# Altium project WiFi_Shield.PrjPcb
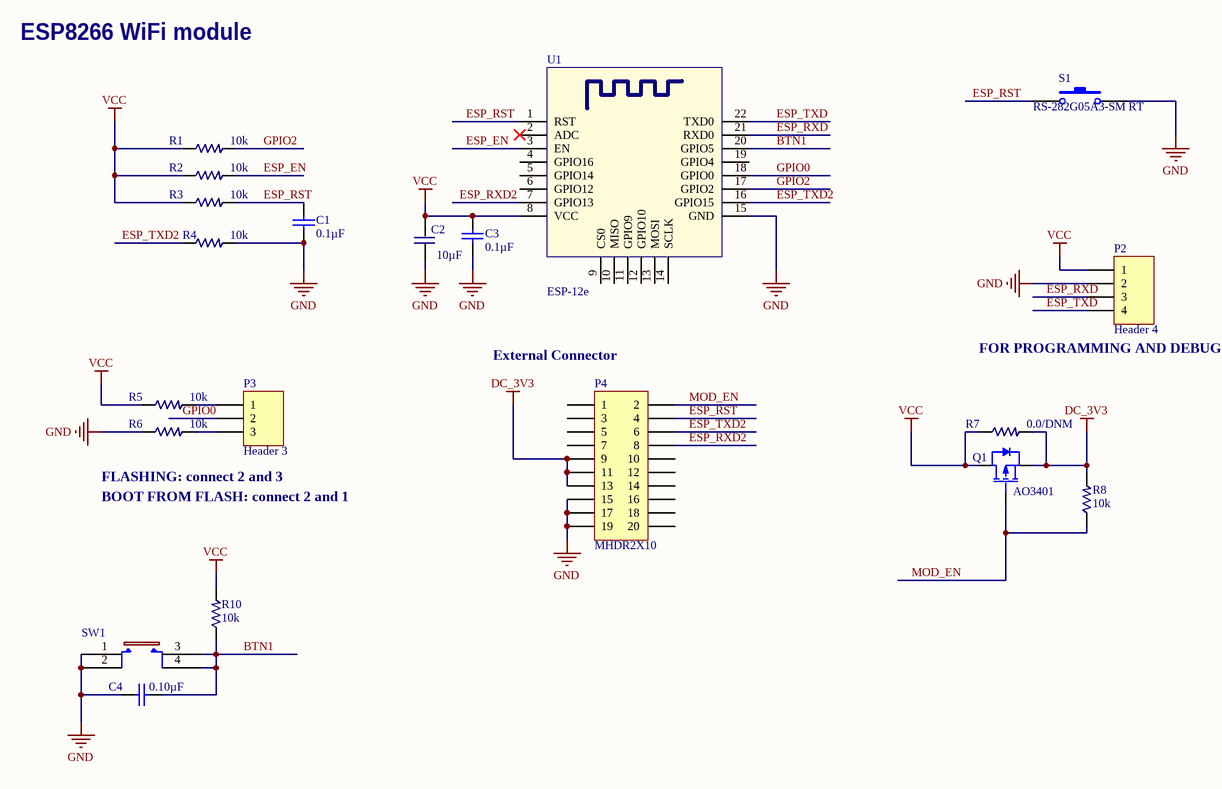
[diagram p0: WiFi Shield Schematic.SchDoc]
1 sheet, 20 parts. Net scope: global (net labels, ports and power ports of the same name join across sheets).
Board file: WiFi_Shield_PCB.PcbDoc

## Sheet WiFi Shield Schematic.SchDoc: WiFi Shield Schematic
size A4

### Parts
C1  0.1µF  [C0402M]
C2  10µF  [C0603M]
C3  0.1µF  [C0402M]
C4  0.10µF  [C0402M]
P2  Header 4  [HDR1X4]
P3  Header 3  [HDR1X3]
P4  MHDR2X10  [MHDR2X10SMDM]
Q1  AO3401  [SOT95P240X120-3N]
R1  10k  [R0402M]
R2  10k  [R0402M]
R3  10k  [R0402M]
R4  10k  [R0402M]
R5  10k  [R0402M]
R6  10k  [R0402M]
R7  0.0/DNM  [R0805M]
R8  10k  [R0402M]
R10  10k  [R0402M]
S1  RS-282G05A3-SM RT  [RS-282G05A3]
SW1  PTS645SL70SMTR92LFS  [PTS645SL70SMTR92LFS]  (value not drawn)
U1  ESP-12e  [ESP-12E]

### Nets
DC_3V3: P4.9 P4.11 P4.13 Q1.2(S) R7.1 R8.1
GND: C1.2 C2.1 C3.2 C4.2 P2.2 P4.15 P4.17 P4.19 R4.1 R6.2 S1.2 SW1.1 SW1.2 U1.15(GND)
VCC: C2.2 C3.1 P2.1 Q1.3(D) R1.2 R2.2 R3.2 R5.2 R7.2 R10.1 U1.8(VCC)
BTN1: C4.1 R10.2 SW1.3 SW1.4 U1.20(GPIO5)
ESP_EN: R2.1 U1.3(EN)
ESP_RST: C1.1 P4.4 R3.1 S1.1 U1.1(RST)
ESP_RXD: P2.3 U1.21(RXD0)
ESP_RXD2: P4.8 U1.7(GPIO13)
ESP_TXD: P2.4 U1.22(TXD0)
ESP_TXD2: P4.6 R4.2 U1.16(GPIO15)
GPIO0: P3.2 U1.18(GPIO0)
GPIO2: R1.1 U1.17(GPIO2)
MOD_EN: P4.2 Q1.1(G) R8.2
NetP3_1: P3.1 R5.1
NetP3_3: P3.3 R6.1

Not connected (* = marked no-connect by the designer): P4 1 3 5 7 10 12 14 16 18 20; U1 2(ADC)* 4(GPIO16) 5(GPIO14) 6(GPIO12) 9(CS0) 10(MISO) 11(GPIO9) 12(GPIO10) 13(MOSI) 14(SCLK) 19(GPIO4)

### Notes on the sheet
- ESP8266 WiFi module
- (near P4) External Connector
- (near P2) FOR PROGRAMMING AND DEBUG
- FLASHING: connect 2 and 3
- BOOT FROM FLASH: connect 2 and 1
- Title
- Size:
- Date:
- A4
- Number:
- Time:
- Revision:
- Sheet
- of
- THRAIN
- ManhNV
- Hanoi
- 27/68
- Vietnam
- File:

### Library data of the parts
C1 C3 = CAPN: Manufacturer: Murata Electronics North America; Manufacturer Part Number: GRM155R61C104KA88J; Tolerance: ±10%; Voltage - Rated: 16V; Temperature Coefficient: X5R; Notification: Current market demand for these product types have resulted in fluctuating and extending lead times. Lead times may differ.; Supplier 1: Digi-Key; Supplier Part Number 1: 490-6310-1-ND; RoHS: RoHS Compliant; Category: Capacitors; Stock 1: 500000; Pricing 1: 1=0.1, 10=0.035, 100=0.0155, 500=0.01106, 1000=0.0087, 2500=0.00791, 5000=0.00727 (USD); Packaging: Cut Tape (CT); Part Status: Active; Operating Temperature: -55°C ~ 85°C; Features: -; Ratings: -; Applications: General Purpose; Mounting Type: Surface Mount, MLCC; Package / Case: 0402 (1005 Metric); Size / Dimension: 0.039" L x 0.020" W (1.00mm x 0.50mm); Height - Seated (Max): -; Thickness (Max): 0.022" (0.55mm); Lead Spacing: -; ComponentLink1URL: https://www.murata.com/~/media/webrenewal/support/library/catalog/products/capacitor/mlcc/c02e.ashx; ComponentLink1Description: https://www.murata.com/~/media/webrenewal/support/library/catalog/products/capacitor/mlcc/c02e.ashx
C2 = CAPSMD: CAP CER 10UF 10V X5R 0603; Manufacturer: Taiyo Yuden; Manufacturer Part Number: LMK107BBJ106MAHT; Tolerance: ±20%; Supplier 1: Digi-Key; Supplier Part Number 1: 587-3412-1-ND; RoHS: RoHS Compliant; Category: Capacitors; Stock 1: 455125; Pricing 1: 1=0.44, 10=0.309, 100=0.1852, 500=0.1389, 1000=0.11729 (USD); Packaging: Cut Tape (CT); Part Status: Active; Voltage - Rated: 10V; Temperature Coefficient: X5R; Operating Temperature: -55°C ~ 85°C; Features: -; Ratings: AEC-Q200; Applications: Automotive; Mounting Type: Surface Mount, MLCC; Package / Case: 0603 (1608 Metric); Size / Dimension: 0.063" L x 0.032" W (1.60mm x 0.80mm); Height - Seated (Max): -; Thickness (Max): 0.035" (0.90mm); Lead Spacing: -; Lead Style: -; ComponentLink1URL: http://ds.yuden.co.jp/TYCOMPAS/ut/detail.do?productNo=LMK107BBJ106MAHT&fileName=LMK107BBJ106MAHT_SS&mode=specSheetDownload; ComponentLink1Description: http://ds.yuden.co.jp/TYCOMPAS/ut/detail.do?productNo=LMK107BBJ106MAHT&fileName=LMK107BBJ106MAHT_SS&mode=specSheetDownload; Capacitance: 10µF
C4 = CAPN: CAP CER 0.1UF 10V X5R 0402; Manufacturer: Taiyo Yuden; Manufacturer Part Number: LMK105BJ104KV-F; Tolerance: ±10%; Module: IPCAM SoC; Category 2: Capacitors; Notification: Current market demand for these product types have resulted in fluctuating and extending lead times. Lead times may differ.; Supplier 1: Digi-Key; Supplier Part Number 1: 587-1227-1-ND; RoHS: RoHS Compliant; Category: Capacitors; Stock 1: 12292406; Pricing 1: 1=0.1, 10=0.025, 50=0.012, 100=0.009, 250=0.00652, 500=0.0048, 1000=0.00325, 5000=0.0025 (USD); Packaging: Cut Tape (CT); Part Status: Active; Capacitance: 0.10µF; Voltage - Rated: 10V; Temperature Coefficient: X5R; Operating Temperature: -55°C ~ 85°C; Features: -; Ratings: -; Applications: General Purpose; Failure Rate: *; Mounting Type: Surface Mount, MLCC; Package / Case: 0402 (1005 Metric); Size / Dimension: 0.039" L x 0.020" W (1.00mm x 0.50mm); Height - Seated (Max): -; Thickness (Max): 0.022" (0.55mm); Lead Spacing: -; Lead Style: -; ComponentLink1URL: http://ds.yuden.co.jp/TYCOMPAS/ut/detail.do?productNo=LMK105BJ104KV-F&fileName=LMK105BJ104KV-F_SS&mode=specSheetDownload; ComponentLink1Description: http://ds.yuden.co.jp/TYCOMPAS/ut/detail.do?productNo=LMK105BJ104KV-F&fileName=LMK105BJ104KV-F_SS&mode=specSheetDownload; Supplier 2: Digi-Key; Supplier Part Number 2: 587-2835-1-ND; Manufacturer 2: Taiyo Yuden; Manufacturer Part Number 2: LMK105BJ104MV-F; RoHS 2: RoHS Compliant; Description 2: CAP CER 0.1UF 10V X5R 0402; Stock 2: 17700; Pricing 2: 1=0.1, 10=0.043, 100=0.019, 500=0.0136, 1000=0.01069, 2500=0.00972, 5000=0.00894 (USD); ComponentLink2URL: http://ds.yuden.co.jp/TYCOMPAS/ut/detail.do?productNo=LMK105BJ104MV-F&fileName=LMK105BJ104MV-F_SS&mode=specSheetDownload; ComponentLink2Description: http://ds.yuden.co.jp/TYCOMPAS/ut/detail.do?productNo=LMK105BJ104MV-F&fileName=LMK105BJ104MV-F_SS&mode=specSheetDownload
P2 = Header 4: Header, 4-Pin; LatestRevisionDate: 17-Jul-2002; LatestRevisionNote: Re-released for DXP Platform.; Publisher: Altium Limited
P3 = Header 3: Header, 3-Pin; LatestRevisionDate: 17-Jul-2002; LatestRevisionNote: Re-released for DXP Platform.; Publisher: Altium Limited
P4 = MHDR2X10: Header, 10-Pin, Dual row; LatestRevisionDate: 17-Jul-2002; LatestRevisionNote: Re-released for DXP Platform.; Publisher: Altium Limited
Q1 = MOSFET-P1: P-Channel MOSFET
R1-R6 R8 = RES_SMD: RES SMD 10K OHM 1% 1/16W 0402; Manufacturer: Vishay Dale; Manufacturer Part Number: CRCW040210K0FKEDC; Power (Watts): 0.063W, 1/16W; Temperature Coefficient: ±100ppm/°C; Supplier 1: Digi-Key; Supplier Part Number 1: 541-3959-1-ND; RoHS: RoHS Compliant; Category: Resistors; Stock 1: 336311; Pricing 1: 1=0.1, 10=0.026, 100=0.0104, 1000=0.00466, 2500=0.00405, 5000=0.00334 (USD); Packaging: Cut Tape (CT); Part Status: Active; Tolerance: ±1%; Composition: Thick Film; Features: -; Operating Temperature: -55°C ~ 155°C; Package / Case: 0402 (1005 Metric); Supplier Device Package: 0402; Size / Dimension: 0.039" L x 0.020" W (1.00mm x 0.50mm); Height - Seated (Max): 0.014" (0.35mm); Failure Rate: -; ComponentLink1URL: http://www.vishay.com/docs/28773/crcwce3.pdf; ComponentLink1Description: http://www.vishay.com/docs/28773/crcwce3.pdf
R7 = RES_SMD
R10 = RES_SMD: RES SMD 10K OHM 1% 1/16W 0402; Manufacturer 1: Yageo; Manufacturer Part Number 1: AT0402FRE0710KL; Category 1: Resistors; Power (Watts): 0.063W, 1/16W; Temperature Coefficient: ±50ppm/°C; Supplier 1: Digi-Key; Supplier Part Number 1: YAG2104CT-ND; RoHS 1: RoHS Compliant; Description 1: RES SMD 10K OHM 1% 1/16W 0402; Stock 1: 128581; Pricing 1: 1=0.15, 10=0.125, 100=0.049, 1000=0.02051, 2500=0.0188, 5000=0.01709 (USD); Packaging: Cut Tape (CT); Part Status: Active; Tolerance: ±1%; Composition: Thin Film; Features: Anti-Sulfur, Automotive AEC-Q200, Moisture Resistant; Operating Temperature: -55°C ~ 155°C; Package / Case: 0402 (1005 Metric); Supplier Device Package: 0402; Size / Dimension: 0.039" L x 0.020" W (1.00mm x 0.50mm); Height - Seated (Max): 0.014" (0.35mm); Failure Rate: -; ComponentLink1URL: http://www.yageo.com/documents/recent/PYu-AT_51_RoHS_L_5.pdf; ComponentLink1Description: http://www.yageo.com/documents/recent/PYu-AT_51_RoHS_L_5.pdf
S1 = SW-PB: SWITCH TACTILE SPST-NO 0.05A 12V; Manufacturer: C&K; Switch Function: Off-Mom; Contact Rating @ Voltage: 0.05A @ 12VDC; Actuator Type: Rectangular Button; Actuator Height off PCB, Vertical: 2.50mm; Actuator Orientation: Top Actuated; Outline: 6.00mm x 3.60mm; Illumination: Non-Illuminated; Operating Force: 250gf; Actuator Material: Polyamide (PA), Nylon; Switch Travel: 0.25mm; Mechanical Life: 50,000 Cycles; Supplier 1: Digi-Key; Supplier Part Number 1: CKN10384CT-ND; Manufacturer Part Number: RS-282G05A3-SM RT; RoHS: RoHS Compliant; Category: Switches; Stock 1: 55078; Pricing 1: 1=0.81, 10=0.78, 25=0.7356, 50=0.6474, 100=0.5885, 250=0.55908, 500=0.54436, 1000=0.42666 (USD); Packaging: Cut Tape (CT); Part Status: Active; Circuit: SPST-NO; Mounting Type: Surface Mount; Actuator Length, Right Angle: -; Termination Style: Gull Wing; Illumination Type, Color: -; Illumination Voltage (Nominal): -; Ingress Protection: -; Features: -; Operating Temperature: -; ComponentLink1URL: https://media.digikey.com/pdf/Data%20Sheets/C&K/RS-282G05A-SM_RT.pdf; ComponentLink1Description: https://media.digikey.com/pdf/Data%20Sheets/C&K/RS-282G05A-SM_RT.pdf
SW1 = A08-0790: SWITCH TACTILE SPST-NO 0.05A 12V; Manufacturer 1: C&K; Category 1: Switches; Switch Function: Off-Mom; Contact Rating @ Voltage: 0.05A @ 12VDC; Actuator Type: Standard; Actuator Height off PCB, Vertical: 7.00mm; Actuator Orientation: Top Actuated; Outline: 6.00mm x 6.00mm; Illumination: Non-Illuminated; Operating Force: 130gf; Actuator Material: Polyamide (PA66), Nylon 6/6; Mechanical Life: 100,000 Cycles; Supplier 1: Digi-Key; Supplier Part Number 1: CKN10820CT-ND; Manufacturer Part Number 1: PTS645SL70SMTR92LFS; RoHS 1: RoHS Compliant; Description 1: SWITCH TACTILE SPST-NO 0.05A 12V; Stock 1: 9940; Pricing 1: 1=0.29, 10=0.28, 25=0.2704, 50=0.2606, 100=0.2461, 250=0.23164 (USD); Packaging: Cut Tape (CT); Part Status: Active; Circuit: SPST-NO; Mounting Type: Surface Mount; Actuator Length, Right Angle: -; Termination Style: Gull Wing; Illumination Type, Color: -; Illumination Voltage (Nominal): -; Ingress Protection: -; Features: -; Switch Travel: -; Operating Temperature: -20°C ~ 60°C; ComponentLink1URL: http://www.ckswitches.com/media/1471/pts645.pdf; ComponentLink1Description: http://www.ckswitches.com/media/1471/pts645.pdf
U1 = ESP-12e: ESP8266 SMT MODULE; Manufacturer: Adafruit Industries LLC; Manufacturer Part Number: 2491; RF Family/Standard: WiFi; Protocol: 802.11b/g/n; Frequency: 2.4GHz; Data Rate: 72.2Mbps; Power - Output: 20.5dBm; Sensitivity: -98dBm; Serial Interfaces: I²C, I²S, SPI, UART; Antenna Type: Integrated, Trace; Voltage - Supply: 3 V ~ 3.6 V; Current - Receiving: 50mA ~ 56mA; Current - Transmitting: 120mA ~ 170mA; Supplier 1: Digi-Key; Supplier Part Number 1: 1528-1438-ND; RoHS: RoHS Compliant; Category: RF/IF and RFID; Stock 1: 493; Pricing 1: 1=6.95 (USD); Packaging: Bulk; Part Status: Obsolete; Modulation: -; Utilized IC / Part: ESP8266; Memory Size: -; Mounting Type: Surface Mount; Operating Temperature: -40°C ~ 125°C; Package / Case: Module; ComponentLink1URL: https://www.adafruit.com/images/product-files/2471/0A-ESP8266__Datasheet__EN_v4.3.pdf; ComponentLink1Description: https://www.adafruit.com/images/product-files/2471/0A-ESP8266__Datasheet__EN_v4.3.pdf